# EAGLE design PaPArray_full (EAGLE 6.3)
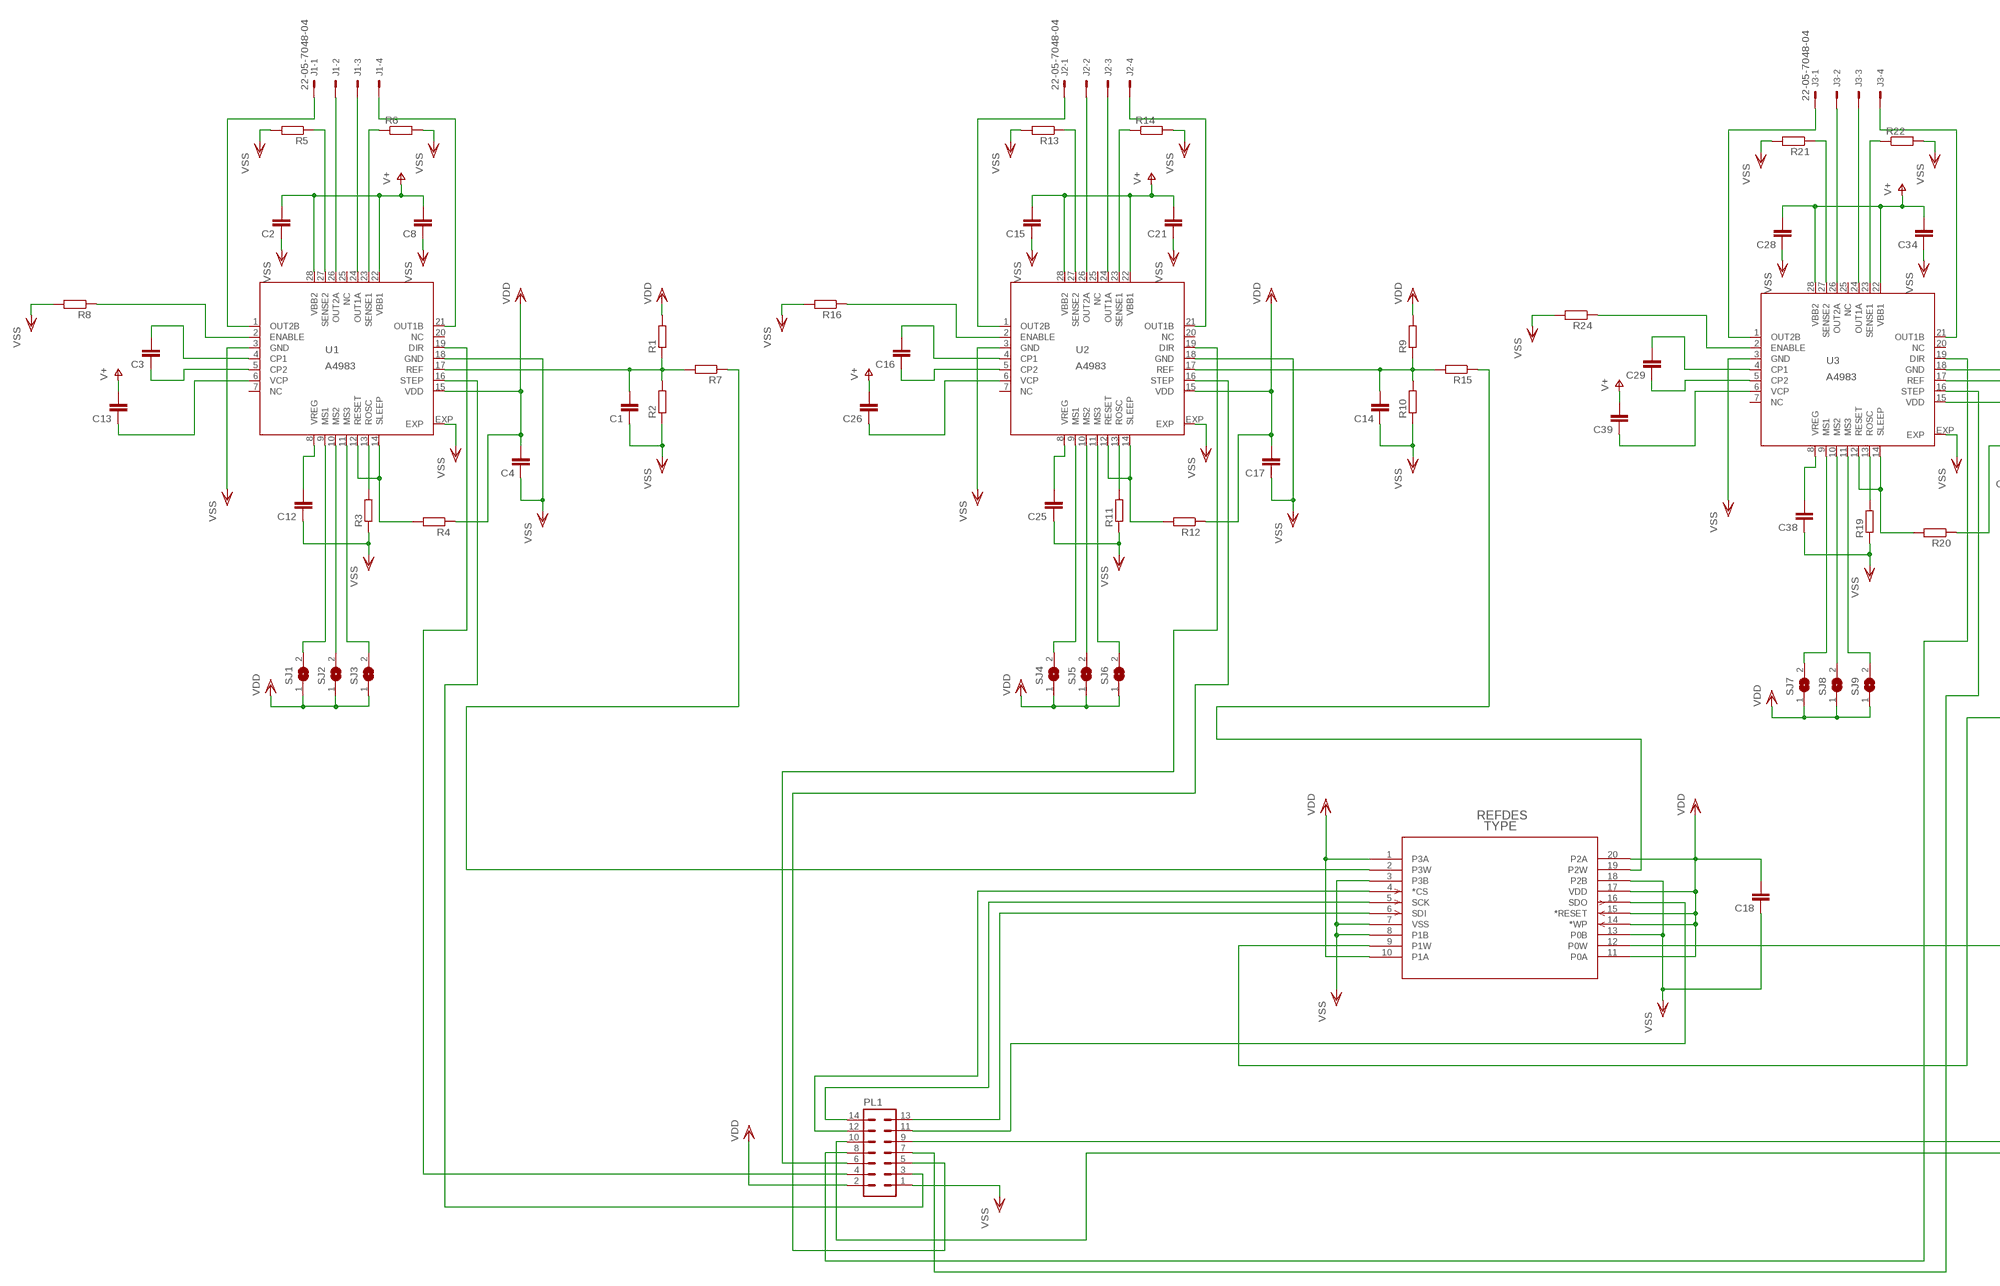
[diagram p0: schematic, sheet 1, part 1 of 2]
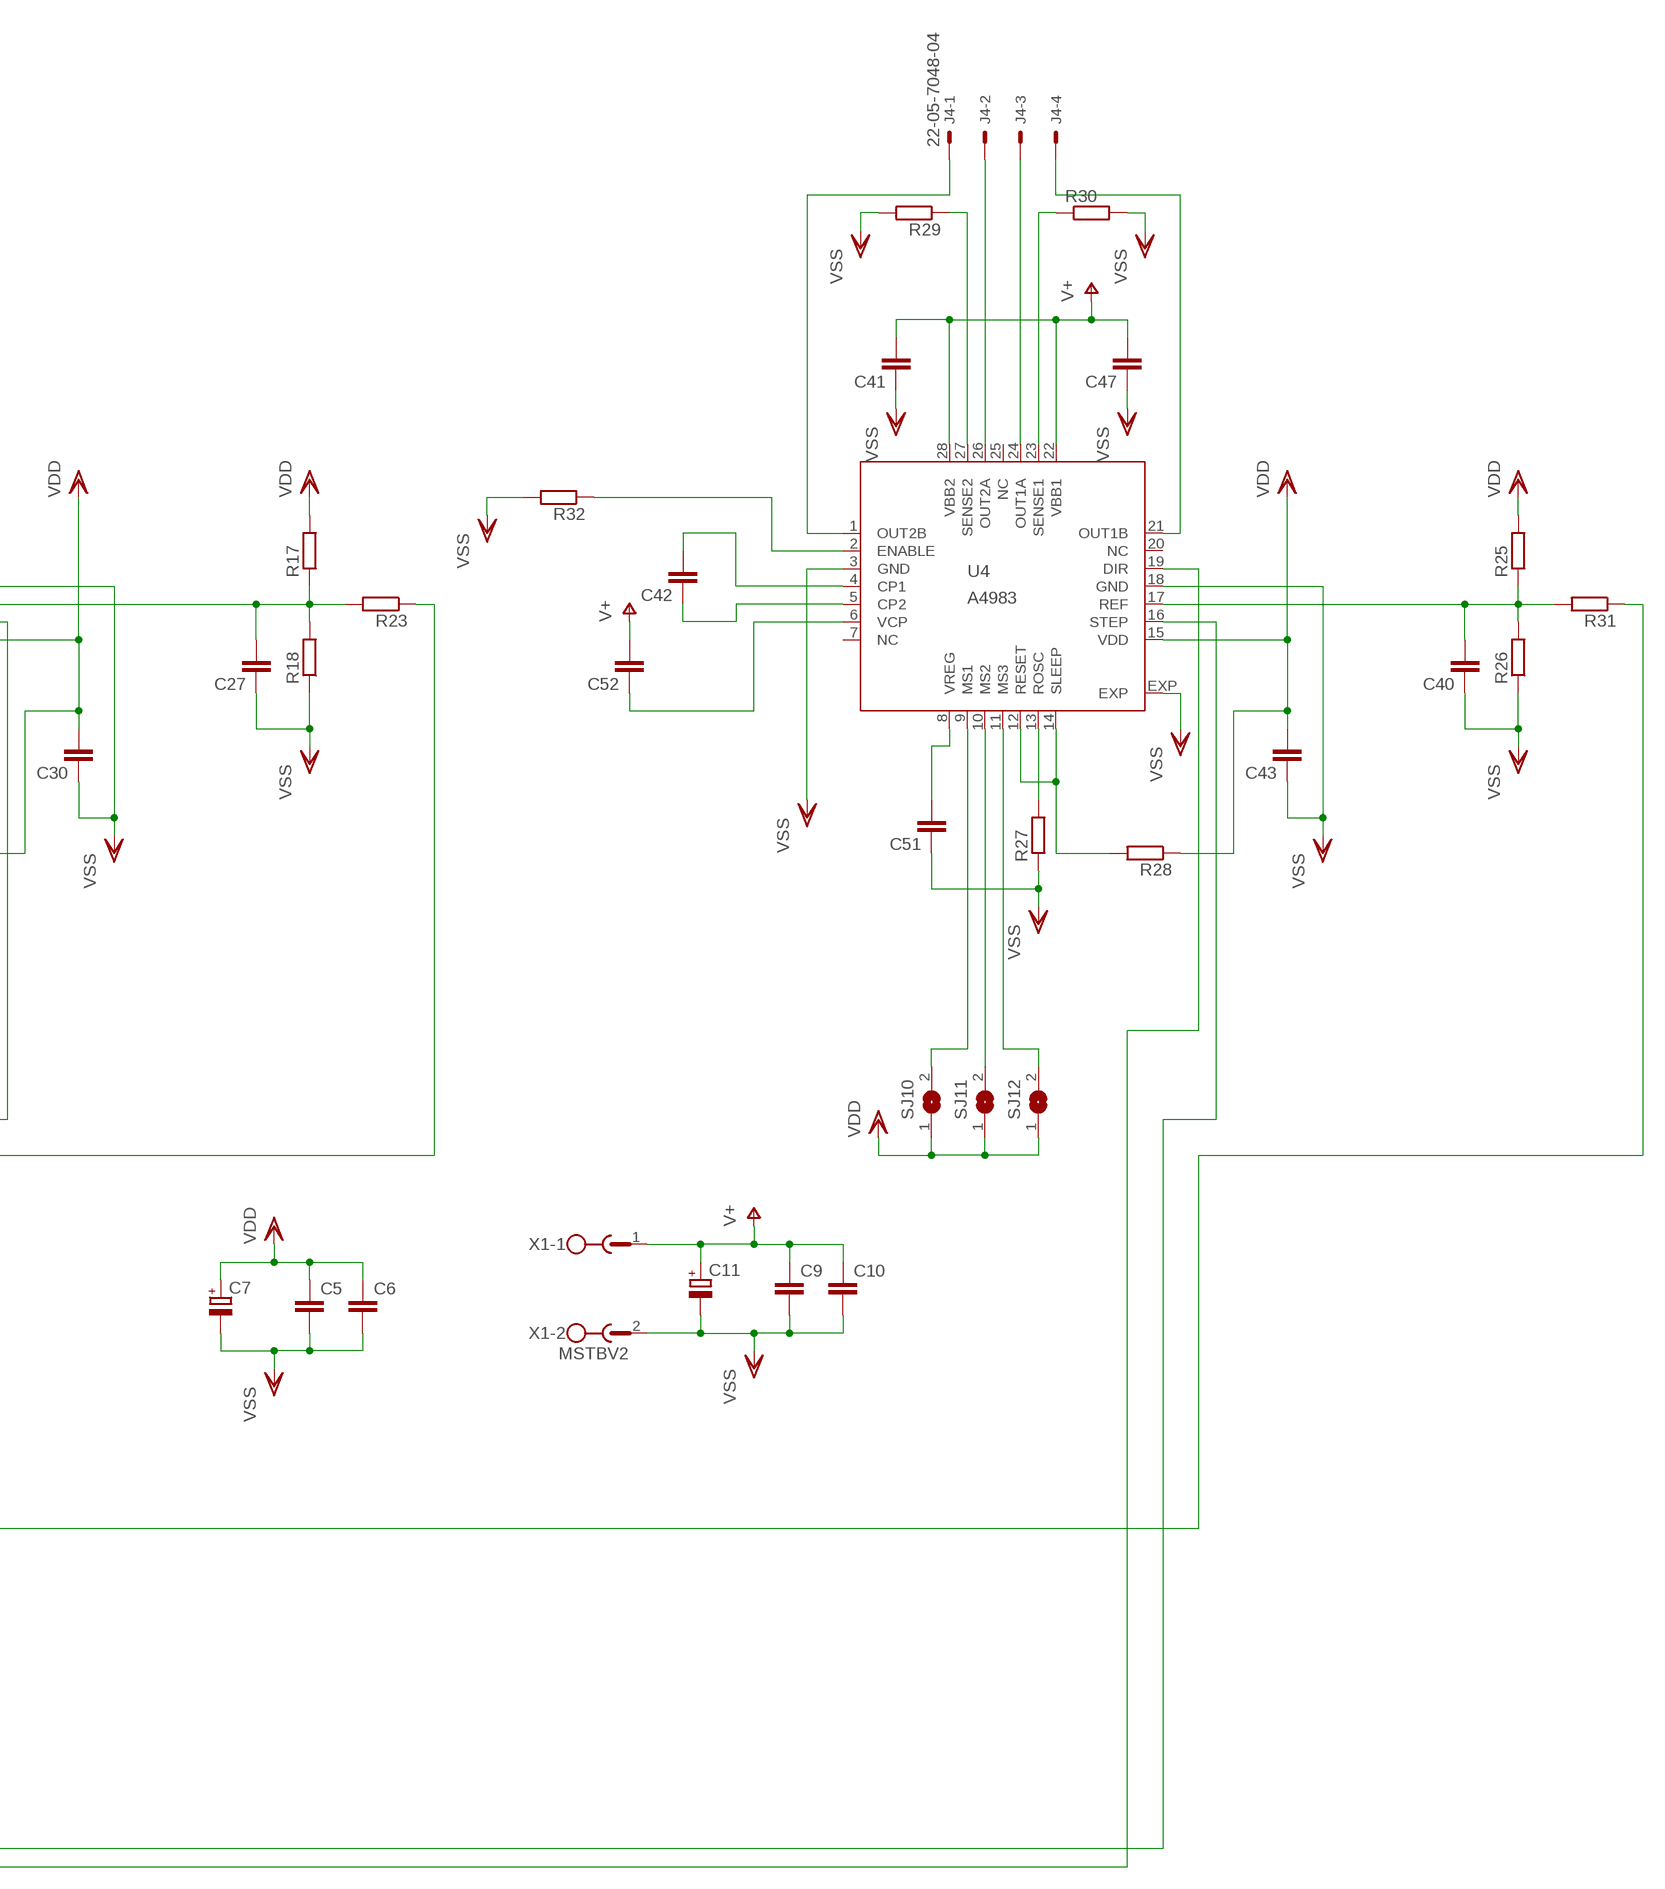
[diagram p1: schematic, sheet 1, part 2 of 2]

## Parts
C1  C-EUC0603  [C0603]
C2  C-EUC0603  [C0603]
C3  C-EUC0603  [C0603]
C4  C-EUC0603  [C0603]
C5  C-EUC0603  [C0603]
C6  C-EUC0603  [C0603]
C7  CPOL-EUE5-5  [E5-5]
C8  C-EUC0603  [C0603]
C9  C-EUC0603  [C0603]
C10  C-EUC0603  [C0603]
C11  CPOL-EUE5-5  [E5-5]
C12  C-EUC0603  [C0603]
C13  C-EUC0603  [C0603]
C14  C-EUC0603  [C0603]
C15  C-EUC0603  [C0603]
C16  C-EUC0603  [C0603]
C17  C-EUC0603  [C0603]
C18  C-EUC0603  [C0603]
C21  C-EUC0603  [C0603]
C25  C-EUC0603  [C0603]
C26  C-EUC0603  [C0603]
C27  C-EUC0603  [C0603]
C28  C-EUC0603  [C0603]
C29  C-EUC0603  [C0603]
C30  C-EUC0603  [C0603]
C34  C-EUC0603  [C0603]
C38  C-EUC0603  [C0603]
C39  C-EUC0603  [C0603]
C40  C-EUC0603  [C0603]
C41  C-EUC0603  [C0603]
C42  C-EUC0603  [C0603]
C43  C-EUC0603  [C0603]
C47  C-EUC0603  [C0603]
C51  C-EUC0603  [C0603]
C52  C-EUC0603  [C0603]
J1  22-05-7048-04  [7395-04]
J2  22-05-7048-04  [7395-04]
J3  22-05-7048-04  [7395-04]
J4  22-05-7048-04  [7395-04]
PL1  14V  [14V]
R1  R-EU_R0805  [R0805]
R2  R-EU_R0805  [R0805]
R3  R-EU_R0805  [R0805]
R4  R-EU_R0805  [R0805]
R5  R-EU_R2512  [R2512]
R6  R-EU_R2512  [R2512]
R7  R-EU_R0805  [R0805]
R8  R-EU_R0805  [R0805]
R9  R-EU_R0805  [R0805]
R10  R-EU_R0805  [R0805]
R11  R-EU_R0805  [R0805]
R12  R-EU_R0805  [R0805]
R13  R-EU_R2512  [R2512]
R14  R-EU_R2512  [R2512]
R15  R-EU_R0805  [R0805]
R16  R-EU_R0805  [R0805]
R17  R-EU_R0805  [R0805]
R18  R-EU_R0805  [R0805]
R19  R-EU_R0805  [R0805]
R20  R-EU_R0805  [R0805]
R21  R-EU_R2512  [R2512]
R22  R-EU_R2512  [R2512]
R23  R-EU_R0805  [R0805]
R24  R-EU_R0805  [R0805]
R25  R-EU_R0805  [R0805]
R26  R-EU_R0805  [R0805]
R27  R-EU_R0805  [R0805]
R28  R-EU_R0805  [R0805]
R29  R-EU_R2512  [R2512]
R30  R-EU_R2512  [R2512]
R31  R-EU_R0805  [R0805]
R32  R-EU_R0805  [R0805]
SJ1  SJ  [SJ]
SJ2  SJ  [SJ]
SJ3  SJ  [SJ]
SJ4  SJ  [SJ]
SJ5  SJ  [SJ]
SJ6  SJ  [SJ]
SJ7  SJ  [SJ]
SJ8  SJ  [SJ]
SJ9  SJ  [SJ]
SJ10  SJ  [SJ]
SJ11  SJ  [SJ]
SJ12  SJ  [SJ]
U1  A4983  [QFN28ET]
U2  A4983  [QFN28ET]
U3  A4983  [QFN28ET]
U4  A4983  [QFN28ET]
U$1  MCP4341-XXXX_ST  [TSSOP20_MC]
X1  MSTBV2  [MSTBV2]

## Nets
N$1: J1.3 U1.24(OUT1A)
N$2: J1.4 U1.21(OUT1B)
N$3: J1.2 U1.26(OUT2A)
N$4: J1.1 U1.1(OUT2B)
N$5: R5.1 U1.27(SENSE2)
N$6: R6.1 U1.23(SENSE1)
N$7: R3.2 U1.13(ROSC)
N$8: C3.2 U1.4(CP1)
N$9: C3.1 U1.5(CP2)
N$10: C1.2 R1.1 R2.2 R7.2 U1.17(REF)
N$11: C12.2 U1.8(VREG)
N$12: R31.1 U$1.12(P0W)
N$13: R4.2 U1.12(RESET) U1.14(SLEEP)
N$14: J2.3 U2.24(OUT1A)
N$15: J2.4 U2.21(OUT1B)
N$16: J2.2 U2.26(OUT2A)
N$17: J2.1 U2.1(OUT2B)
N$18: R13.1 U2.27(SENSE2)
N$19: SJ1.2 U1.9(MS1)
N$20: SJ2.2 U1.10(MS2)
N$21: SJ3.2 U1.11(MS3)
N$22: R7.1 U$1.2(P3W)
N$23: PL1.3 U1.16(STEP)
N$24: PL1.4 U1.19(DIR)
N$25: C13.1 U1.6(VCP)
N$26: R14.1 U2.23(SENSE1)
N$27: C14.2 R9.1 R10.2 R15.2 U2.17(REF)
N$28: C16.2 U2.4(CP1)
N$29: C16.1 U2.5(CP2)
N$30: R11.2 U2.13(ROSC)
N$31: C25.2 U2.8(VREG)
N$32: R12.2 U2.12(RESET) U2.14(SLEEP)
N$33: SJ4.2 U2.9(MS1)
N$34: SJ5.2 U2.10(MS2)
N$35: SJ6.2 U2.11(MS3)
N$36: PL1.5 U2.16(STEP)
N$37: PL1.6 U2.19(DIR)
N$38: C26.1 U2.6(VCP)
N$39: PL1.12 U$1.4(*CS)
N$40: R15.1 U$1.19(P2W)
N$41: J3.3 U3.24(OUT1A)
N$42: J3.4 U3.21(OUT1B)
N$43: J3.2 U3.26(OUT2A)
N$44: J3.1 U3.1(OUT2B)
N$45: R21.1 U3.27(SENSE2)
N$46: R22.1 U3.23(SENSE1)
N$47: C27.2 R17.1 R18.2 R23.2 U3.17(REF)
N$48: C29.2 U3.4(CP1)
N$49: C29.1 U3.5(CP2)
N$50: R19.2 U3.13(ROSC)
N$51: C38.2 U3.8(VREG)
N$52: R20.2 U3.12(RESET) U3.14(SLEEP)
N$53: SJ7.2 U3.9(MS1)
N$54: SJ8.2 U3.10(MS2)
N$55: SJ9.2 U3.11(MS3)
N$56: PL1.7 U3.16(STEP)
N$57: PL1.8 U3.19(DIR)
N$58: C39.1 U3.6(VCP)
N$59: R16.1 U2.2(ENABLE)
N$60: PL1.14 U$1.5(SCK)
N$61: J4.3 U4.24(OUT1A)
N$62: J4.4 U4.21(OUT1B)
N$63: J4.2 U4.26(OUT2A)
N$64: J4.1 U4.1(OUT2B)
N$65: R29.1 U4.27(SENSE2)
N$66: R30.1 U4.23(SENSE1)
N$67: C40.2 R25.1 R26.2 R31.2 U4.17(REF)
N$68: C42.2 U4.4(CP1)
N$69: C42.1 U4.5(CP2)
N$70: R27.2 U4.13(ROSC)
N$71: C51.2 U4.8(VREG)
N$72: R28.2 U4.12(RESET) U4.14(SLEEP)
N$73: SJ10.2 U4.9(MS1)
N$74: SJ11.2 U4.10(MS2)
N$75: SJ12.2 U4.11(MS3)
N$76: PL1.9 U4.16(STEP)
N$78: C52.1 U4.6(VCP)
N$79: R23.1 U$1.9(P1W)
N$80: PL1.13 U$1.6(SDI)
N$81: PL1.11 U$1.16(SDO)
N$82: R32.1 U4.2(ENABLE)
N$83: R8.1 U1.2(ENABLE)
N$84: R24.1 U3.2(ENABLE)
N$85: PL1.10 U4.19(DIR)
V+: C2.2 C8.2 C9.1 C10.1 C11.+ C13.2 C15.2 C21.2 C26.2 C28.2 C34.2 C39.2 C41.2 C47.2 C52.2 U1.22(VBB1) U1.28(VBB2) U2.22(VBB1) U2.28(VBB2) U3.22(VBB1) U3.28(VBB2) U4.22(VBB1) U4.28(VBB2) X1.1
VDD: C4.2 C5.1 C6.1 C7.+ C17.2 C18.2 C30.2 C43.2 PL1.2 R1.2 R4.1 R9.2 R12.1 R17.2 R20.1 R25.2 R28.1 SJ1.1 SJ2.1 SJ3.1 SJ4.1 SJ5.1 SJ6.1 SJ7.1 SJ8.1 SJ9.1 SJ10.1 SJ11.1 SJ12.1 U1.15(VDD) U2.15(VDD) U3.15(VDD) U4.15(VDD) U$1.1(P3A) U$1.10(P1A) U$1.11(P0A) U$1.14(*WP) U$1.15(*RESET) U$1.17(VDD) U$1.20(P2A)
VSS: C1.1 C2.1 C4.1 C5.2 C6.2 C7.- C8.1 C9.2 C10.2 C11.- C12.1 C14.1 C15.1 C17.1 C18.1 C21.1 C25.1 C27.1 C28.1 C30.1 C34.1 C38.1 C40.1 C41.1 C43.1 C47.1 C51.1 PL1.1 R2.1 R3.1 R5.2 R6.2 R8.2 R10.1 R11.1 R13.2 R14.2 R16.2 R18.1 R19.1 R21.2 R22.2 R24.2 R26.1 R27.1 R29.2 R30.2 R32.2 U1.3(GND) U1.18(GND) U1.EXP U2.3(GND) U2.18(GND) U2.EXP U3.3(GND) U3.18(GND) U3.EXP U4.3(GND) U4.18(GND) U4.EXP U$1.3(P3B) U$1.7(VSS) U$1.8(P1B) U$1.13(P0B) U$1.18(P2B) X1.2
Unconnected: U1.7(NC) U1.20(NC) U1.25(NC) U2.7(NC) U2.20(NC) U2.25(NC) U3.7(NC) U3.20(NC) U3.25(NC) U4.7(NC) U4.20(NC) U4.25(NC)

## Library data of the parts
C1-C6 C8-C10 C12-C18 C21 C25-C30 C34 C38-C43 C47 C51 C52 = rcl:C-EU: CAPACITOR, European symbol
C7 C11 = rcl:CPOL-EU: POLARIZED CAPACITOR, European symbol
J1-J4 = con-molex:22-?-04: CONNECTOR wire to board 2.54 mm (.1 inch) pitch header; OC_FARNELL: unknown; OC_NEWARK: unknown
PL1 = con-harting-v:14V: CONNECTOR; OC_FARNELL: unknown; OC_NEWARK: unknown
R1-R32 = rcl:R-EU_: RESISTOR, European symbol
SJ1-SJ12 = jumper:SJ: SMD solder JUMPER
U1-U4 = allegro:A4983: DMOS Microstepping Driver with Translator Auto generated by make-symbol-device-package-bsdl.ulp Rev. 32 Source: http://www.allegromicro.com/en/Products/Part_Numbers/4983/4983.pdf; MPN: A4983SETTR-T; OC_FARNELL: 1688956; OC_NEWARK: 39M6763
U$1 = microchip_mcp41xx:MCP4341-XXXX_ST
X1 = con-phoenix-508:MSTBV2: PHOENIX; MPN: MSTBV 2,5/2-GF-5.08; OC_FARNELL: 1792792; OC_NEWARK: 69R9845

## Board
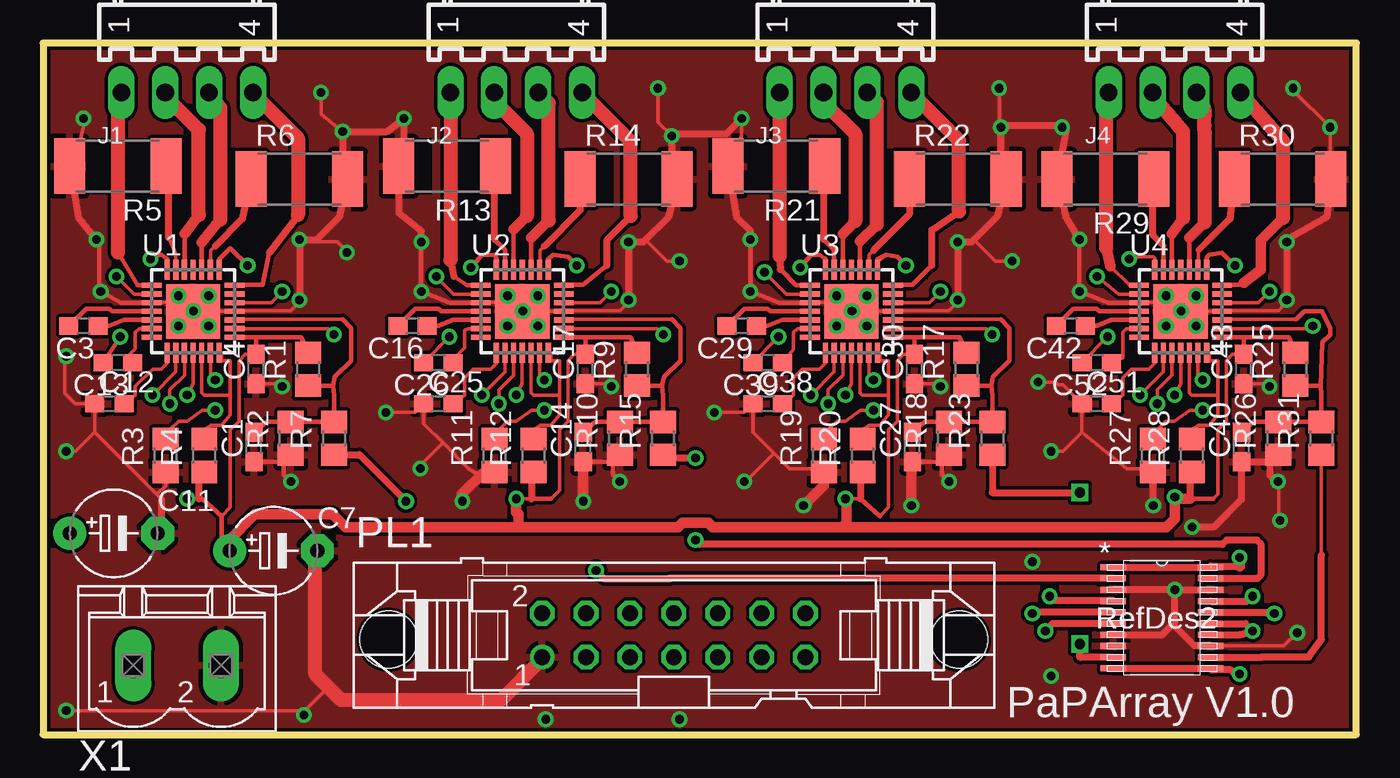
[diagram p2: board, top side]
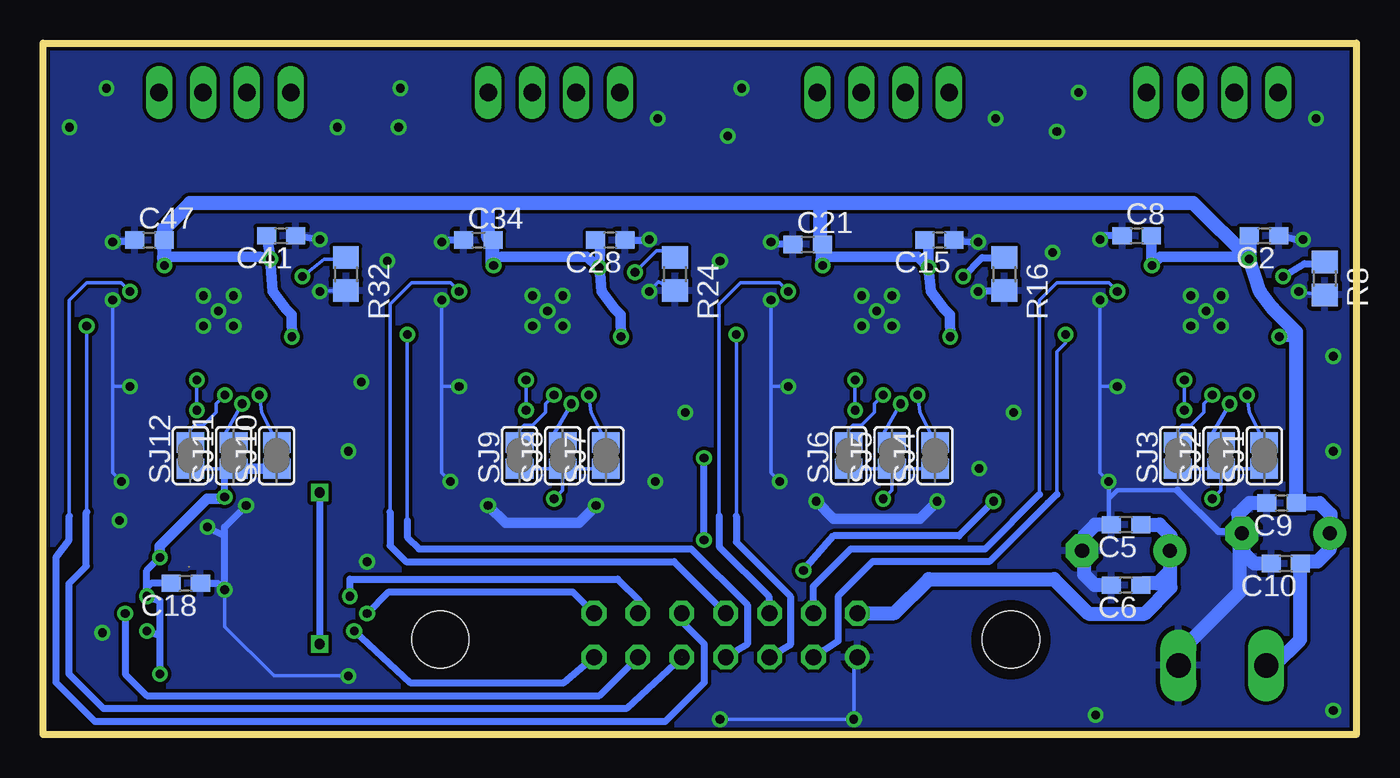
[diagram p3: board, bottom side, seen from below]

Size 76 x 40 mm. Coordinates in mm from the lower left corner, seen from the top.
Outline: 0,0 76,0 76,40 0,40 0,0
Copper layers (1*16): Top 0.035mm / dielectric 1.5mm / Bottom 0.035mm
Design rules "dipole_elec": minimum track width 0.2mm, minimum drill 0.3mm, track to track 0.2mm, track to pad 0.2mm, pad to pad 0.2mm, via to via 0.2mm, smd to smd 0.2mm, copper to edge 0.2mm, drill to drill 0.2mm, minimum pad ring 10mil, minimum via ring 8mil, stop-mask expansion 4mil, vias tented up to drill 0mil, thermal gap 10mil
tRestrict: area 2.5,31.2 to 3.5,34.5; area 5,31.2 to 6,34.5; area 13,30.5 to 14,33.8; area 15.5,30.5 to 16.5,33.8; area 21.5,31.2 to 22.5,34.5; area 24.2,31.2 to 25.2,34.5; area 32,30.5 to 33,33.8; area 34.8,30.5 to 35.8,33.8; area 40.8,31.2 to 41.8,34.5; area 43.2,31.2 to 44.2,34.5; area 51.2,30.5 to 52.2,33.8; area 53.8,30.5 to 54.8,33.8; 4 more areas

### Footprints (pad centres in the part's own frame; a part is rotated, then mirrored left to right if it is on the bottom)
C0603 = smd 1.1 x 1: 1 -0.85,0; 2 0.85,0
E5-5 = drill 0.813 pad 1.905: + -2.54,0 | drill 0.813 pad 1.905 octagon: - 2.54,0
7395-04 = drill 1.016 long: 1 3.81,0; 2 1.27,0; 3 -1.27,0; 4 -3.81,0
14V = drill 0.914: 1 -7.62,-1.27 | drill 0.914 octagon: 2 -7.62,1.27; 3 -5.08,-1.27; 4 -5.08,1.27; 5 -2.54,-1.27; 6 -2.54,1.27; 7 0,-1.27; 8 0,1.27; 9 2.54,-1.27; 10 2.54,1.27; 11 5.08,-1.27; 12 5.08,1.27; 13 7.62,-1.27; 14 7.62,1.27 | hole 3.302: 16.51,-0.254; -16.51,-0.254
R0805 = smd 1.3 x 1.5: 1 -0.95,0; 2 0.95,0
R2512 = smd 1.8 x 3.2: 1 -2.8,0; 2 2.8,0
SJ = smd 1.168 x 1.6: 1 -0.762,0; 2 0.762,0
QFN28ET = smd 1.15 x 0.3: 1 -2.4,1.5; 2 -2.4,1; 3 -2.4,0.5; 4 -2.4,0; 5 -2.4,-0.5; 6 -2.4,-1; 7 -2.4,-1.5; 15 2.4,-1.5; 16 2.4,-1; 17 2.4,-0.5; 18 2.4,0; 19 2.4,0.5; 20 2.4,1; 21 2.4,1.5 | smd 0.3 x 1.15: 8 -1.5,-2.4; 9 -1,-2.4; 10 -0.5,-2.4; 11 0,-2.4; 12 0.5,-2.4; 13 1,-2.4; 14 1.5,-2.4; 22 1.5,2.4; 23 1,2.4; 24 0.5,2.4; 25 0,2.4; 26 -0.5,2.4; 27 -1,2.4; 28 -1.5,2.4 | smd 3.15 x 3.15: EXP 0,0
TSSOP20_MC = smd 1.473 x 0.356: 1 -2.819,2.921; 2 -2.819,2.286; 3 -2.819,1.626; 4 -2.819,0.965; 5 -2.819,0.33; 6 -2.819,-0.33; 7 -2.819,-0.965; 8 -2.819,-1.626; 9 -2.819,-2.286; 10 -2.819,-2.921; 11 2.819,-2.921; 12 2.819,-2.286; 13 2.819,-1.626; 14 2.819,-0.965; 15 2.819,-0.33; 16 2.819,0.33; 17 2.819,0.965; 18 2.819,1.626; 19 2.819,2.286; 20 2.819,2.921
MSTBV2 = drill 1.397 long: 1 -2.54,0; 2 2.54,0

### Placement (x,y rotation side)
C1  12.21,16.64 90 top
C2  5.33,28.86 180 bottom
C3  2.33,23.64 180 top
C4  12.33,21.14 90 top
C5  13.33,12.14 180 bottom
C6  13.33,8.64 180 bottom
C7  13.33,10.64 0 top
C8  12.71,28.86 0 bottom
C9  4.33,13.39 180 bottom
C10  4.08,9.89 180 bottom
C11  4.08,11.64 0 top
C12  3.83,19.14 0 top
C13  4.33,21.52 180 top
C14  31.25,16.64 90 top
C15  24.13,28.61 180 bottom
C16  21.38,23.64 180 top
C17  31.38,21.14 90 top
C18  67.75,8.75 180 bottom
C21  31.75,28.36 0 bottom
C25  22.88,19.14 0 top
C26  22.88,21.52 180 top
C27  50.3,16.64 90 top
C28  43.18,28.61 180 bottom
C29  40.43,23.64 180 top
C30  50.43,21.14 90 top
C34  50.8,28.61 0 bottom
C38  41.93,19.14 0 top
C39  41.93,21.52 180 top
C40  69.36,16.64 90 top
C41  62.23,28.86 180 bottom
C42  59.48,23.64 180 top
C43  69.48,21.14 90 top
C47  69.86,28.61 0 bottom
C51  60.98,19.14 0 top
C52  60.98,21.52 180 top
J1  8.33,37.14 180 top
J2  27.38,37.14 180 top
J3  46.43,37.14 180 top
J4  65.48,37.14 180 top
PL1  36.5,5.75 0 top
R1  15.33,21.14 90 top
R2  14.33,17.14 90 top
R3  7.08,16.14 90 top
R4  9.33,16.14 90 top
R5  4.33,32.89 180 top
R6  14.83,32.14 0 top
R7  16.83,17.14 90 top
R8  1.83,26.39 270 bottom
R9  34.38,21.14 90 top
R10  33.38,17.14 90 top
R11  26.13,16.14 90 top
R12  28.38,16.14 90 top
R13  23.38,32.89 180 top
R14  33.88,32.14 0 top
R15  35.88,17.14 90 top
R16  20.38,26.64 270 bottom
R17  53.43,21.14 90 top
R18  52.43,17.14 90 top
R19  45.18,16.14 90 top
R20  47.43,16.14 90 top
R21  42.43,32.89 180 top
R22  52.93,32.14 0 top
R23  54.93,17.14 90 top
R24  39.43,26.64 270 bottom
R25  72.48,21.14 90 top
R26  71.48,17.14 90 top
R27  64.23,16.14 90 top
R28  66.48,16.14 90 top
R29  61.48,32.14 180 top
R30  71.73,32.14 0 top
R31  73.98,17.14 90 top
R32  58.48,26.64 270 bottom
SJ1  5.33,16.14 90 bottom
SJ2  7.83,16.14 90 bottom
SJ3  10.33,16.14 90 bottom
SJ4  24.38,16.14 90 bottom
SJ5  26.88,16.14 90 bottom
SJ6  29.38,16.14 90 bottom
SJ7  43.43,16.14 90 bottom
SJ8  45.93,16.14 90 bottom
SJ9  48.43,16.14 90 bottom
SJ10  62.48,16.14 90 bottom
SJ11  64.98,16.14 90 bottom
SJ12  67.48,16.14 90 bottom
U1  8.68,24.49 0 top
U2  27.73,24.49 0 top
U3  46.78,24.49 0 top
U4  65.83,24.49 0 top
U$1  64.75,6.75 0 top
X1  7.75,4 0 top

### Tracks (layer width: path | path; a pad name or v marks a point on that pad's centre or on a via)
N$1
  Top 0.254: U1.24 9.18,28.49
  Top 0.61: 9.18,28.49 10.25,29.81
  Top 0.813: J1.3 10.25,36.24 10.25,29.81
N$2
  Top 0.254: U1.21 11.11,26.02 12.71,26.02 13.08,27.89
  Top 0.406: J1.4 12.14,37.11 | 14.75,30.06 13.08,27.89
  Top 0.813: 12.14,37.11 14.75,34.5 14.75,30.06
N$3
  Top 0.254: U1.26 8.18,28.99
  Top 0.61: 8.18,28.99 9,30.06
  Top 0.813: 9,30.06 9,35 7.06,36.94 J1.2
N$4
  Top 0.254: U1.1 5.48,25.99 4.33,27.89
  Top 0.813: 4.33,27.89 4.33,36.83 J1.1
N$5
  Top 0.2: U1.27 7.68,27.82 7.25,28.75
  Top 0.254: 7.08,32.84 R5.1
  Top 0.406: 7.25,28.75 7.25,32.76 7.08,32.84
N$6
  Top 0.2: 9.71,26.91 9.71,28.02 9.96,28.27
  Top 0.254: 9.71,26.91 U1.23
  Top 0.406: R6.1 11.53,29.84 9.96,28.27
N$7  (via drill 0.5 pad 0.25)
  Top 0.2: R3.2 7.33,17.64 7.83,18.14 8.33,18.14 9.21,18.77 v9.96,18.77 | U1.13 9.68,20.79 v9.96,20.52
  Bottom 0.2: v9.96,20.52 v9.96,18.77
N$8
  Top 0.254: U1.4 3.98,24.49 3.83,24.64 2.48,24.64 C3.2
N$9
  Top 0.254: U1.5 4.68,23.99 3.83,23.64 C3.1
N$10
  Top 0.2: 17.33,24.02 11.11,24.02
  Top 0.254: 16.78,20.19 16.83,19.64 R7.2 R2.2 12.93,18.09 C1.2 | R1.1 16.78,20.19 | 16.78,20.19 16.88,20.69 17.83,21.64 17.83,23.52 17.33,24.02 | 11.11,24.02 U1.17
N$11
  Top 0.2: U1.8 7.18,21.49 6.83,21.14 6.33,21.14 5.33,20.14 5.33,19.64 C12.2
N$12
  Top 0.2: R31.1 73.98,10.39
  Top 0.406: 73.98,10.39 73.98,5.5 73.25,4.5 70.5,4.5 | 70.5,4.46 70.5,4.5 | U$1.12 70.46,4.46 70.5,4.5
N$13
  Top 0.2: U1.12 9.18,19.79 9.33,19.64 10.83,19.64 | 10.83,19.64 10.83,21.64 10.33,21.64 10.33,21.94 U1.14 | R4.2 9.33,17.64 9.71,17.89 10.33,17.89 10.83,18.52 10.83,19.64
N$14
  Top 0.254: U2.24 28.23,28.74
  Top 0.406: 28.23,28.74 28.24,28.74
  Top 0.61: 28.24,28.74 29.25,29.75
  Top 0.813: 29.25,29.75 29.25,36.54 J2.3
N$15
  Top 0.254: U2.21 30.16,26.02 31.25,26.02 32.63,27.14
  Top 0.406: 32.63,27.14 32.64,28.64 34,30
  Top 0.813: 34,30 34,34.33 J2.4
N$16
  Top 0.254: U2.26 27.23,29.24
  Top 0.61: 28,30.01 27.23,29.24
  Top 0.813: 28,30.01 28,34.75 26.38,36.37 26.38,36.91 26.34,36.91 J2.2
N$17
  Top 0.254: U2.1 24.53,25.99 23.76,26.51
  Top 0.406: 23.57,27.45 23.76,26.51
  Top 0.813: J2.1 23.57,27.45
N$18
  Top 0.254: U2.27 26.73,28.04 26.13,28.64 | 26.13,31.34 R13.1
  Top 0.406: 26.13,28.64 26.13,31.34
N$19  (via drill 0.5 pad 0.25)
  Top 0.2: U1.9 7.68,20.99 v6.33,19.64
  Bottom 0.2: 5.33,17.14 SJ1.2 6.21,18.65 v6.33,19.64
N$20  (via drill 0.5 pad 0.25)
  Top 0.2: U1.10 8.18,20.79 7.33,19.94 v7.33,19.14
  Bottom 0.2: v7.33,19.14 8.33,17.4 SJ2.2
N$21  (via drill 0.5 pad 0.25)
  Top 0.2: U1.11 8.68,20.29 v8.33,19.64
  Bottom 0.2: v8.33,19.64 8.83,19.14 8.83,18.64 9.58,17.89 10.08,17.89 10.33,17.64 SJ3.2
N$22  (via drill 0.5)
  Top 0.406: 36.21,9.04 36.25,9 | 36.25,9 32.5,9 v32,9.5 | R7.1 18.31,16.19 v21,13.5 | U$1.2 36.29,9.04 36.25,9
  Bottom 0.406: v21,13.5 23,11.5 30.25,11.5 v32,9.5
N$23  (via drill 0.5 pad 0.25)
  Top 0.2: U1.16 16.48,23.49 v16.83,23.14
  Bottom 0.2: 17.33,13.89 17.33,22.14 16.83,22.64 v16.83,23.14
  Bottom 0.406: 17.33,13.89 17.86,13.39 21.25,10 28,10 30,8 30,5.4 PL1.3
N$24  (via drill 0.5 pad 0.25)
  Top 0.2: v13.83,25.64 13.18,24.99 U1.19
  Bottom 0.2: v13.83,25.64 14.33,26.14 17.33,26.14 18.33,25.14 18.33,13.89
  Bottom 0.406: PL1.4 31.42,8.58 29.25,10.75 21.47,10.75 18.33,13.89
N$25
  Top 0.2: U1.6 5.55,23.49 5.33,23.27 5.33,22.33 5.12,22.12 4.83,21.79 C13.1
N$26
  Top 0.2: 28.75,26.91 28.75,28.02 29,28.27
  Top 0.254: 28.75,26.91 U2.23
  Top 0.406: R14.1 31.08,30.34 29,28.27
N$27
  Top 0.2: 36.38,24.02 30.16,24.02
  Top 0.254: 35.83,20.19 35.88,19.64 R15.2 R10.2 31.98,18.09 C14.2 | R9.1 35.83,20.19 | 35.83,20.19 35.93,20.69 36.88,21.64 36.88,23.52 36.38,24.02 | 30.16,24.02 U2.17
N$28
  Top 0.254: U2.4 23.03,24.49 22.88,24.64 21.53,24.64 C16.2
N$29
  Top 0.254: U2.5 23.73,23.99 22.88,23.64 C16.1
N$30  (via drill 0.5 pad 0.25)
  Top 0.2: R11.2 26.38,17.64 26.88,18.14 27.38,18.14 28.25,18.77 v29,18.77 | U2.13 28.73,20.79 v29,20.52
  Bottom 0.2: v29,20.52 v29,18.77
N$31
  Top 0.2: U2.8 26.23,21.49 25.88,21.14 24.88,21.14 24.38,20.64 24.38,19.64 C25.2
N$32
  Top 0.2: U2.12 28.23,19.79 28.38,19.64 29.88,19.64 | 29.88,19.64 29.88,21.64 29.38,21.64 29.38,21.94 U2.14 | R12.2 28.38,17.64 28.75,17.89 29.38,17.89 29.88,18.52 29.88,19.64
N$33  (via drill 0.5 pad 0.25)
  Top 0.2: U2.9 26.73,20.99 v25.38,19.64
  Bottom 0.2: 24.38,17.14 SJ4.2 25.25,18.65 v25.38,19.64
N$34  (via drill 0.5 pad 0.25)
  Top 0.2: U2.10 27.23,20.79 26.38,19.94 v26.38,19.14
  Bottom 0.2: v26.38,19.14 27.38,17.4 SJ5.2
N$35  (via drill 0.5 pad 0.25)
  Top 0.2: U2.11 27.73,20.29 v27.38,19.64
  Bottom 0.2: v27.38,19.64 27.88,19.14 27.88,18.64 28.63,17.89 29.13,17.89 29.38,17.64 SJ6.2
N$36  (via drill 0.5 pad 0.25)
  Top 0.2: U2.16 35.53,23.49 v35.88,23.14
  Bottom 0.2: 35.88,12.64 v35.88,23.14
  Bottom 0.406: 35.88,12.64 35.88,11.13 32.75,8 32.75,5.19 PL1.5
N$37  (via drill 0.5 pad 0.25)
  Top 0.2: v32.88,25.64 32.23,24.99 U2.19
  Bottom 0.2: v32.88,25.64 33.38,26.14 35.63,26.14 36.88,24.89 36.88,12.64
  Bottom 0.406: 36.88,12.64 36.88,10.88 34,8 34,7.06 PL1.6
N$38
  Top 0.2: U2.6 24.61,23.49 24.38,23.39 24.38,22.38 24,22 23.88,21.79 C26.1
N$39  (via drill 0.5)
  Top 0.406: U$1.4 61.93,7.75 58.5,7.75 v58.25,8
  Bottom 0.406: v58.25,8 58.25,9 42.75,9 41.5,7.75 41.5,7.1 PL1.12
N$40  (via drill 0.5)
  Top 0.406: v37.75,11.25 38,11 68.25,11 68.5,11.25 70.25,11.25 70.5,11 70.5,9.25 70.29,9.04 U$1.19 | v37.75,16 36.07,16
  Top 0.61: 36.07,16 R15.1
  Bottom 0.406: v37.75,11.25 v37.75,16
N$41
  Top 0.254: U3.24 47.28,28.49
  Top 0.406: 47.28,28.49 47.28,28.53
  Top 0.61: 47.28,28.53 48.25,29.5
  Top 0.813: 48.25,29.5 48.25,36.59 J3.3
N$42
  Top 0.254: U3.21 49.2,26.02 50.3,26.02 51.43,27.14
  Top 0.406: 51.43,27.14 51.43,29.18 53,30.25
  Top 0.813: 53,30.25 53,34.38 J3.4
N$43
  Top 0.254: U3.26 46.28,28.99
  Top 0.61: 47,29.71 46.28,28.99
  Top 0.813: J3.2 45.16,36.59 47,34.75 47,29.71
N$44
  Top 0.254: U3.1 43.58,25.99 42.66,26.91
  Top 0.406: 42.62,27.7 42.66,26.91
  Top 0.813: J3.1 42.62,27.7
N$45
  Top 0.254: U3.27 45.78,28.04 45.18,28.64 | 45.18,31.34 R21.1
  Top 0.406: 45.18,28.64 45.18,31.34
N$46
  Top 0.2: 47.8,26.91 47.8,27.77 48.05,28.02
  Top 0.254: 47.8,26.91 U3.23
  Top 0.406: R22.1 50.13,30.09 48.05,28.02
N$47
  Top 0.2: 55.43,24.02 49.2,24.02
  Top 0.254: 54.88,20.19 54.93,19.64 R23.2 R18.2 51.03,18.09 C27.2 | R17.1 54.88,20.19 | 54.88,20.19 54.98,20.69 55.93,21.64 55.93,23.52 55.43,24.02 | 49.2,24.02 U3.17
N$48
  Top 0.254: U3.4 42.08,24.49 41.93,24.64 40.58,24.64 C29.2
N$49
  Top 0.254: U3.5 42.78,23.99 41.93,23.64 C29.1
N$50  (via drill 0.5 pad 0.25)
  Top 0.2: R19.2 45.43,17.64 45.93,18.14 46.43,18.14 47.3,18.77 v48.05,18.77 | U3.13 47.78,20.79 v48.05,20.52
  Bottom 0.2: v48.05,20.52 v48.05,18.77
N$51
  Top 0.2: U3.8 45.28,21.49 44.93,21.14 43.93,21.14 43.43,20.64 43.43,19.64 C38.2
N$52
  Top 0.2: U3.12 47.28,19.79 47.43,19.64 48.93,19.64 | 48.93,19.64 48.93,21.64 48.43,21.64 48.43,21.94 U3.14 | R20.2 47.43,17.64 47.8,17.89 48.43,17.89 48.93,18.52 48.93,19.64
N$53  (via drill 0.5 pad 0.25)
  Top 0.2: U3.9 45.78,20.99 v44.43,19.64
  Bottom 0.2: 43.43,17.14 SJ7.2 44.3,18.65 v44.43,19.64
N$54  (via drill 0.5 pad 0.25)
  Top 0.2: U3.10 46.28,20.79 45.43,19.94 v45.43,19.14
  Bottom 0.2: v45.43,19.14 46.43,17.4 SJ8.2
N$55  (via drill 0.5 pad 0.25)
  Top 0.2: U3.11 46.78,20.29 v46.43,19.64
  Bottom 0.2: v46.43,19.64 46.93,19.14 46.93,18.64 47.68,17.89 48.18,17.89 48.43,17.64 SJ9.2
N$56  (via drill 0.5 pad 0.25)
  Top 0.2: U3.16 54.58,23.49 v54.93,23.14
  Bottom 0.2: 54.93,12.39 v54.93,23.14
  Bottom 0.406: 54.93,12.39 54.93,11.43 54.25,10.75 38.5,10.75 35.25,7.5 35.25,5.23 PL1.7
N$57  (via drill 0.5 pad 0.25)
  Top 0.2: v51.93,25.64 51.28,24.99 U3.19
  Bottom 0.2: v51.93,25.64 52.43,26.14 54.68,26.14 55.93,24.89 55.93,12.89
  Bottom 0.406: 55.93,12.89 55.93,10.93 55,10 39.48,10 PL1.8
N$58
  Top 0.2: U3.6 43.66,23.49 43.43,23.27 43.43,22.29 C39.1
N$59  (via drill 0.5)
  Top 0.2: U2.2 23.76,25.49 v22.75,26.5
  Bottom 0.406: v22.75,26.5 21.66,27.59 R16.1
N$60  (via drill 0.5)
  Top 0.406: U$1.5 57.33,7.08 v57.25,7
  Bottom 0.406: v57.25,7 56,8.25 45.35,8.25 PL1.14
N$61
  Top 0.254: U4.24 66.33,28.74 | 66.98,36.91 J4.3
  Top 0.61: 66.33,28.74 67.23,29.64
  Top 0.813: 67.23,29.64 67.23,34.64 67.2,35.24 67.23,36.14 66.98,36.91
N$62
  Top 0.254: U4.21 68.25,26.02 69.36,26.02 69.48,26.14
  Top 0.61: 69.48,26.14 70.48,26.89 70.48,28.6 71.77,29.89
  Top 0.813: 71.77,29.89 71.77,34.33 J4.4
N$63
  Top 0.254: U4.26 65.33,28.99
  Top 0.61: 65.33,28.99 65.98,29.89
  Top 0.813: 65.98,29.89 65.98,34.89 64.48,36.64 64.48,36.91 J4.2
N$64
  Top 0.2: 61.77,27.1 62.88,25.99
  Top 0.254: U4.1 62.88,25.99
  Top 0.61: 61.52,28.14 61.77,27.1
  Top 0.813: 61.52,28.14 61.52,36.45 J4.1
N$65
  Top 0.254: U4.27 64.83,28.29 | 64.23,31.09 R29.1
  Top 0.305: 64.83,28.29 64.23,28.89
  Top 0.406: 64.23,28.89 64.23,31.09
N$66
  Top 0.2: 66.86,26.91 66.86,28.02
  Top 0.254: 66.86,26.91 U4.23
  Top 0.305: 66.86,28.02 67.36,28.52
  Top 0.406: R30.1 68.68,29.84 67.36,28.52
N$67
  Top 0.2: 72.48,24.02 68.25,24.02
  Top 0.254: 73.93,20.19 73.98,19.64 R31.2 R26.2 70.08,18.09 C40.2 | R25.1 73.93,20.19 | 73.93,20.19 74.03,22.69 74.48,23.14 74.48,23.52 74,24.5 73,24.5 72.52,24.02 72.48,24.02 | 68.25,24.02 U4.17
N$68
  Top 0.254: U4.4 61.13,24.49 60.98,24.64 59.63,24.64 C42.2
N$69
  Top 0.254: U4.5 61.83,23.99 60.98,23.64 C42.1
N$70  (via drill 0.5 pad 0.25)
  Top 0.2: R27.2 64.48,17.64 64.98,18.14 65.48,18.14 66.36,18.77 v67.11,18.77 | U4.13 66.83,20.79 v67.11,20.52
  Bottom 0.2: v67.11,20.52 v67.11,18.77
N$71
  Top 0.2: U4.8 64.33,21.49 63.98,21.14 62.98,21.14 62.48,20.64 62.48,19.64 C51.2
N$72
  Top 0.2: U4.12 66.33,19.79 66.48,19.64 67.98,19.64 | 67.98,19.64 67.98,21.64 67.48,21.64 67.48,21.94 U4.14 | R28.2 66.48,17.64 66.86,17.89 67.48,17.89 67.98,18.52 67.98,19.64
N$73  (via drill 0.5 pad 0.25)
  Top 0.2: U4.9 64.83,20.99 v63.48,19.64
  Bottom 0.2: 62.48,17.14 SJ10.2 63.35,18.65 v63.48,19.64
N$74  (via drill 0.5 pad 0.25)
  Top 0.2: U4.10 65.33,20.79 64.48,19.94 v64.48,19.14
  Bottom 0.2: v64.48,19.14 65.48,17.4 SJ11.2
N$75  (via drill 0.5 pad 0.25)
  Top 0.2: U4.11 65.83,20.29 v65.48,19.64
  Bottom 0.2: v65.48,19.64 65.98,19.14 65.98,18.64 66.73,17.89 67.23,17.89 67.48,17.64 SJ12.2
N$76  (via drill 0.5 pad 0.25)  (1 unrouted)
  Top 0.2: U4.16 73.13,23.49 v73.48,23.64
  Bottom 0.2: 73.48,12.89 v73.48,23.64
  Bottom 0.406: 39.04,4.46 42.25,1.5 72.5,1.5 74.5,3.5 74.5,8.75 73.5,9.75 73.5,12.87 73.48,12.89
N$78
  Top 0.2: U4.6 62.7,23.49 62.48,23.27 62.48,21.79 C52.1
N$79  (via drill 0.6)
  Top 0.406: v60,5.25 60,4.5 60.04,4.46 U$1.9 | R23.1 54.93,14 v60,14
  Bottom 0.406: v60,14 v60,5.25
N$80  (via drill 0.5)
  Top 0.406: U$1.6 58.42,6.42 v58,6
  Bottom 0.406: v58,6 54.75,3 45.85,3 PL1.13
N$81  (via drill 0.5)
  Top 0.406: U$1.16 71.17,7.08 v71.25,7
  Bottom 0.406: v71.25,7 71.25,3.5 70,2.25 43.81,2.25 PL1.11
N$82  (via drill 0.5)
  Top 0.2: U4.2 62.26,25.49 v61,26.5
  Bottom 0.2: v61,26.5 59.75,27.5 58.57,27.5 R32.1
  Bottom 0.254: R32.1 58.5,28
N$83  (via drill 0.5)
  Top 0.2: U1.2 5.26,25.49 v4.25,26.5
  Bottom 0.406: v4.25,26.5 3,27.25 1.99,27.25 R8.1
N$84  (via drill 0.5)
  Top 0.2: U3.2 43.01,25.49 v41.75,26.75
  Bottom 0.2: v41.75,26.75 40.5,28 39.52,28 R24.1
  Bottom 0.254: R24.1 39.5,27.5
N$85  (via drill 0.5 pad 0.25)
  Top 0.2: v70.98,25.64 70.33,24.99 U4.19
  Bottom 0.2: v70.98,25.64 71.48,26.14 73.48,26.14 74.48,25.14 74.48,12.64
  Bottom 0.406: 74.48,12.64 74.5,12.62 74.5,11.25 75.25,10.25 75.25,3 73,0.75 40,0.75 37.75,3 37.75,5.25 39.02,6.52 PL1.10
V+  (via drill 0.5 pad 0.25)
  Top 0.2: U1.22 10.18,27.49 | C13.2 v4.46,23.02 | U4.22 67.33,27.49 | C52.2 v61.6,23.02 | U3.22 48.28,27.49 | C39.2 v42.55,23.02 | U2.22 29.23,27.49 | C26.2 v23.5,23.02 | U4.28 64.33,27.56 64.25,27.64 63.48,27.64 v62.85,27.52
  Top 0.254: 10.21,27.52 10.21,27.41 U1.22 | U1.28 7.18,27.54 6.83,27.77 6.33,27.74 v6.21,27.52 | 10.18,27.49 10.21,27.52 | 10.21,27.52 10.83,28.14 v11.83,27.14 | 67.36,27.52 67.36,27.41 U4.22 | 67.33,27.49 67.36,27.52 | 67.36,27.52 67.36,27.61 67.5,27.75 68.23,27.89 v68.98,27.14 | 48.8,27.77 48.3,27.41 U3.22 | U3.28 45.28,27.54 44.93,27.77 44.43,27.74 v43.8,27.02 | 48.28,27.49 48.8,27.77 | 48.8,27.77 49.43,27.64 v49.93,27.14 | U2.28 26.23,27.54 26.13,27.77 25.38,27.74 v24.75,27.02 | 29.23,27.49 29.5,27.77 30.38,27.64 v30.88,27.14
  Bottom 0.254: 6.33,27.64 v6.21,27.52 | C47.2 69,28.16 | 69,27.61 68.48,27.64 | v49.93,27.14 49.43,27.64 | v30.88,27.14 30.38,27.64
  Bottom 0.406: 62.83,27.54 v62.85,27.52 | 6.18,27.79 v6.21,27.52 | C15.2 24.75,28.34 | C28.2 43.78,28.29 | C34.2 49.95,27.41 v49.93,27.14 50,27.21 | v11.83,27.14 11.75,27.22 | v30.88,27.14 30.75,27.27 30.75,28.5 31,28.75 | 50,28.5 50.25,28.75
  Bottom 0.61: 6.33,27.64 11.33,27.64 v11.83,27.14 11.86,27.41 C8.2 | v4.46,23.02 3.48,23.02 | 68.48,27.64 63.48,27.64 v62.85,27.52 62.73,25.64 61.98,24.64 61.63,24.29 61.63,24.02 v61.6,23.02 | v43.8,27.02 43.68,25.64 42.93,24.64 42.58,24.29 42.58,24.02 v42.55,23.02 | 49.43,27.64 44.55,27.64 v43.8,27.02 | v24.75,27.02 24.63,25.64 23.88,24.64 23.53,24.29 23.53,24.02 v23.5,23.02 | 30.38,27.64 25.38,27.64 v24.75,27.02 | C41.2 62.83,27.54 | 24.75,28.34 v24.75,27.02 | 43.78,28.29 v43.8,27.02
  Bottom 0.813: 69,28.16 69,27.61 v68.98,27.14 | C2.2 6.18,27.79 | C21.2 30.91,27.41 v30.88,27.14 | 31,30.75 9.44,30.75 v6.21,27.52 5.58,25.64 4.83,24.64 3.48,23.29 3.48,23.02 C9.1 2.14,13.39 1.5,12.75 1.5,11.68 C11.+ 1.54,10.71 2.25,10 3.12,10 C10.1 3.25,9.87 3.25,5.5 4.75,4 X1.1 | 31,30.75 50.25,30.75 | 50.25,30.75 67.5,30.75 69,29.25 C47.2 | 31,28.75 31,30.75 | 50,27.21 50,28.5 | 50.25,28.75 50.25,30.75
VDD  (via drill 0.5, 0.5 pad 0.25)  (1 unrouted)
  Top 0.2: v8.33,13.64 9,13.64 9.21,13.64 | C4.2 11.68,21.99 11.33,21.64 11.33,18.14 10.83,17.64 10.83,13.14 10.33,12.64 | v46.43,13.64 47.3,13.64 | C30.2 49.78,21.99 49.43,21.64 49.43,18.14 48.93,17.64 48.93,13.14 48.43,12.64 | C43.2 68.83,21.99 68.48,21.64 68.48,18.14 67.98,17.64 67.98,13.89 67.73,13.64 | v27.38,13.64 28.25,13.64 | C17.2 30.73,21.99 30.38,21.64 30.38,18.14 29.88,17.64 29.88,14.14 29.38,13.64
  Top 0.254: U1.15 12.33,22.99 | 12.33,22.99 14.93,22.99 R1.2 | C4.2 12.33,22.99 | 9.21,13.64 10.33,12.64 10.33,11.1 C7.+ | U3.15 50.43,22.99 | 50.43,22.99 53.03,22.99 R17.2 | C30.2 50.43,22.99 | 47.3,13.64 48.43,12.64 | U4.15 69.48,22.99 | 69.48,22.99 72.08,22.99 R25.2 | C43.2 69.48,22.99 | 66.36,13.64 67.73,13.64 | U2.15 31.38,22.99 | 31.38,22.99 33.98,22.99 R9.2 | C17.2 31.38,22.99 | 28.25,13.64 29.38,13.64
  Top 0.406: R12.1 28.25,15.19 28.25,13.64 | R4.1 9,15.19 9,13.64 | R20.1 47.3,15.19 47.3,13.64 | R28.1 66.36,15.19 66.36,13.64 | U$1.17 69.72,7.71 v70,8 | U$1.15 69.58,6.42 v70,6 69.28,5.79 U$1.14 | 67.57,9.75 69.25,9.75 | U$1.1 U$1.20 | U$1.10 U$1.11 67.65,3.75 68.75,3.75 69,3.5 v69.25,3.5
  Top 0.61: v27.38,13.64 27.38,12.87 27.5,12.75 27.5,12 | 27.5,12 36.75,12 37,12.25 38.5,12.25 38.75,12 46.25,12 | 46.25,12 46.5,12.25 46.5,13.57 v46.43,13.64 | 46.25,12 65,12 65.5,12.5 v65.5,13.75 65.61,13.64 66.36,13.64 | 27.5,12 17.5,12 16.75,12.75 12.25,12.75 10.75,11.25 10.75,10.68 C7.+ | 69.25,9.75 v69.25,10.25
  Bottom 0.2: SJ1.1 SJ2.1 | SJ2.1 SJ3.1 | SJ2.1 7.83,14.14 v8.33,13.64 | SJ7.1 SJ8.1 | SJ8.1 SJ9.1 | SJ8.1 45.93,14.14 v46.43,13.64 | SJ10.1 SJ11.1 SJ12.1 | SJ4.1 SJ5.1 | SJ5.1 SJ6.1 | SJ5.1 26.88,14.14 v27.38,13.64
  Bottom 0.406: 69.25,5.75 69.25,7.75 v70,8 70,8.5 | 69.25,5.75 v69.25,3.5 | v70,6 69.25,5.75 | v65.5,13.75 65.5,14.86 SJ11.1 | 70,8.5 70,9.5 v69.25,10.25 | C18.2 69.75,8.75 70,8.5
  Bottom 0.61: SJ10.1 64.87,15.38 65,15.25 | v69.25,10.25 69.25,10.89 66.5,13.64 65.61,13.64 v65.5,13.75
  Bottom 0.813: PL1.2 26.73,7.02 24.75,9 17.5,9 15.5,7 12.25,7 10.75,8.5 10.75,10.6 C7.+ | C5.1 11.39,12.14 10.75,11.5 10.75,10.68 C7.+ | C7.+ 10.79,9.46 11.5,8.75 12.37,8.75 C6.1
VSS  (via drill 0.5, 0.5 pad 0.25)
  Top 0.2: 14.83,25.02 14.33,24.52 11.11,24.52 | 6.33,25.02 8.08,25.02 8.08,24.52 v8.71,24.52 | C4.1 13.68,20.29 v13.83,20.14 | 2.98,17.49 C12.1 1.86,19.14 1.25,19.75 1.25,21.81 v1.33,21.89 | 2.98,17.49 6.58,13.89 | 6.58,13.89 6.83,13.64 | R5.2 2.03,33.84 2.33,35.14 v2.33,35.64 | 17.33,32.34 R6.2 | R3.1 7.08,14.39 6.58,13.89 | U1.18 9.33,24.49 | 9.33,24.49 8.73,24.49 v8.71,24.52 | v9.58,25.39 v8.71,24.52 | v9.58,23.64 9.58,24.24 9.33,24.49 | v7.83,23.64 U1.EXP 7.83,25.34 v7.83,25.39 | 33.88,25.02 33.38,24.52 30.16,24.52 | 25.38,25.02 27.13,25.02 27.13,24.52 v27.75,24.52 | C17.1 32.73,20.29 v32.88,20.14 | 23.14,16.89 22.03,17.99 C25.1 21.53,18.64 v19.83,18.64 | 23.14,16.89 24.63,15.39 25,15.14 25.49,15.16 R11.1 | R13.2 20.83,33.59 20.88,33.89 | R14.2 36.38,32.34 v36.38,34.64 35.58,35.44 v35.58,37.39 | U2.18 28.38,24.49 | 28.38,24.49 27.78,24.49 v27.75,24.52 | v28.63,25.39 v27.75,24.52 | v28.63,23.64 28.63,24.24 28.38,24.49 | v26.88,23.64 U2.EXP 26.88,25.34 v26.88,25.39 | 52.93,25.02 52.43,24.52 49.2,24.52 | 44.43,25.02 46.18,25.02 46.18,24.52 v46.8,24.52 | C30.1 51.78,20.29 v51.93,20.14 | 42.28,16.29 41.08,17.49 C38.1 40.58,18.64 v38.83,18.64 | 42.28,16.29 43.18,15.39 45.18,15.39 R19.1 | R21.2 40.13,33.84 40.43,34.64 v40.43,35.64 | 55.43,32.34 R22.2 | U3.18 47.43,24.49 | 47.43,24.49 46.83,24.49 v46.8,24.52 | v47.68,25.39 v46.8,24.52 | v47.68,23.64 47.68,24.24 47.43,24.49 | v45.93,23.64 U3.EXP 45.93,25.34 v45.93,25.39 | 71.98,25.02 71.48,24.52 68.25,24.52 | 63.48,25.02 65.23,25.02 65.23,24.52 v65.86,24.52 | C43.1 70.83,20.29 v70.98,20.14 | 60.13,17.49 C51.1 59.02,20.25 58.75,20.25 58.61,20.39 v57.58,20.39 | 60.13,17.49 62.73,15.39 63.73,15.39 R27.1
  Top 0.2: R30.2 74.48,32.34 v74.48,35.14 72.33,37.29 v72.33,37.39 | U4.18 66.48,24.49 | 66.48,24.49 65.88,24.49 v65.86,24.52 | v66.73,25.39 v65.86,24.52 | v66.73,23.64 66.73,24.24 66.48,24.49 | v64.98,23.64 U4.EXP 64.98,25.34 v64.98,25.39 | v16.08,37.14 16.08,35.89 v17.33,34.89 | v55.33,37.39 55.33,35.24 v55.43,35.14 | v56.08,27.39 55.11,27.39 53.87,28.64 | v58.33,16.39 59.03,16.39 60.13,17.49 | 71.5,14.5 71.5,12.47 v71.58,12.39 | U$1.13 71.81,5.12 v72.58,5.89 | 16.5,2.75 15.08,1.33 v15.08,1.14 14.83,1.39 v1.33,1.39 | v1.33,16.39 1.88,16.39 2.98,17.49 | v17.58,27.89 17.58,27.92 17,28.5 14.97,28.5 v14.83,28.64 | v36.83,27.39 36.11,27.39 34.87,28.63 | v40.58,14.64 40.64,14.64 42.28,16.29 | v21.83,15.39 21.83,15.58 23.14,16.89
  Top 0.254: 11.11,24.52 U1.18 | U1.3 4.48,24.99 v3.33,25.64 3.25,25.75 3.25,28.25 3.08,28.42 v3.08,28.64 | C1.1 13.93,15.79 | 13.93,15.79 R2.1 14.88,16.19 | v14.83,25.14 14.96,25.02 14.83,25.02 | 13.93,15.79 13.93,15.04 v14.33,14.64 | 30.16,24.52 U2.18 | U2.3 23.53,24.99 v21.88,25.64 v21.88,28.5 21.88,28.64 | C14.1 32.98,15.79 | 32.98,15.79 R10.1 33.93,16.19 | v33.88,25.14 34.01,25.02 33.88,25.02 | 32.98,15.79 32.98,15.04 v33.38,14.64 | 49.2,24.52 U3.18 | U3.3 42.58,24.99 v40.93,25.64 v40.93,28.64 | C27.1 52.03,15.79 | 52.03,15.79 R18.1 52.98,16.19 | v52.93,25.14 53.05,25.02 52.93,25.02 | 52.03,15.79 52.03,15.04 v52.43,14.64 | 68.25,24.52 U4.18 | U4.3 61.63,24.99 v59.98,25.64 v59.98,28.64 | C40.1 71.08,15.79 | 71.08,15.79 R26.1 72.03,16.19 | v71.98,25.14 72.11,25.02 71.98,25.02 | 71.08,15.79 71.08,15.04 v71.48,14.64
  Top 0.406: R6.2 17.13,29.94 15.83,28.64 v14.83,28.64 14.83,25.02 | R5.2 2.03,29.94 v3.08,28.64 | 17.33,32.34 v17.33,34.89 19.88,34.89 v20.88,35.64 20.88,33.89 | R14.2 36.18,29.94 34.87,28.63 34.74,28.5 v33.88,28.5 33.88,25.02 | R13.2 20.58,30.19 21.88,29.14 v21.88,28.5 | R22.2 55.23,30 53.87,28.64 53.73,28.5 v52.93,28.5 52.93,25.02 | R21.2 40.13,29.94 40.93,29.14 v40.93,28.64 | R30.2 74.28,29.94 71.98,28.64 v71.98,28.5 71.98,25.02 | v59.98,28.64 59.18,29.94 R29.2 59.18,34.91 58.95,35.14 | 36.38,32.34 v36.38,34.63 36.5,34.75 39.54,34.75 v40.43,35.64 | 55.43,32.34 v55.43,35.14 55.43,35.18 55.5,35.25 58.84,35.25 58.95,35.14 | v64.25,13.25 64.25,15.17 R27.1 | 71.5,14.5 71,15 71,15.75 70.96,15.79 C40.1 69.36,13.61 67.75,12 v66.5,12 | 58.95,35.14 v58.98,35.14 | v65.5,8.38 U$1.18 | v65.5,8.38 U$1.3 | U$1.7 64.78,5.79 65.38,6.38 | 65.38,6.38 65.5,6.5 v65.5,8.38 | U$1.13 66.63,5.12 65.38,6.38 | 6.83,13.64 6.83,11.85 C11.-
  Top 0.61: C14.1 v31.25,13.51 v31.25,13.5 | v24.25,13.5 24.25,13.92 25.49,15.16 | 45.18,15.39 45.18,14.43 v44,13.25 | v50.25,13.25 50.25,15.73 C27.1
  Top 0.813: PL1.1 28.88,4.38 26.5,2 17.25,2 16.5,2.75 15.75,3.5 15.75,10.52 C7.-
  Bottom 0.2: v14.83,25.14 14.83,20.14 | 14.83,20.14 14.83,15.14 v14.33,14.64 | v13.83,20.14 14.83,20.14 | R8.2 2.28,25.44 v3.33,25.64 | v33.88,25.14 33.88,20.14 | 33.88,20.14 33.88,15.14 v33.38,14.64 | v32.88,20.14 33.88,20.14 | v52.93,25.14 52.93,20.14 | 52.93,20.14 52.93,15.14 v52.43,14.64 | v51.93,20.14 52.93,20.14 | R24.2 40.38,26.19 v40.93,25.64 | v71.98,25.14 71.98,20.14 | 71.98,20.14 71.98,15.14 v71.48,14.64 | v70.98,20.14 71.98,20.14 | R32.2 59.43,25.69 v59.98,25.64 | v58.33,3.39 62.64,3.39 65.5,6.25 v65.5,8.38 | v36.83,0.89 v29.08,0.89 29.08,4.28 PL1.1
  Bottom 0.254: 10.33,14.14 13.83,14.14 14.33,13.64 | 14.33,13.64 14.33,12.29 C5.2 | v14.33,14.64 14.33,13.64 | 61.13,28.54 C41.1
  Bottom 0.406: 65.5,11.5 v65.5,8.38 65.87,8.75 C18.1 | 65.5,11.5 65.5,12 v64.25,13.25 | v59.98,28.64 60.1,28.64 C41.1 | C47.1 70.95,28.52 v71.98,28.5 | v3.08,28.64 3.51,28.64 C2.1 | C8.1 14.61,28.86 v14.83,28.64 | v21.88,25.64 21.83,25.69 R16.2 | C15.1 22.42,28.5 v21.88,28.5 | C21.1 33.77,28.36 v33.88,28.5 | C28.1 40.96,28.61 v40.93,28.64 | C34.1 52.82,28.61 v52.93,28.5 | v66.5,12 65.5,11.5 | 10.33,14.14 10.33,14.08 8,11.75 6.73,11.75 C11.-
  Bottom 0.61: v31.25,13.5 30.25,12.5 25.25,12.5 v24.25,13.5 | v44,13.25 45,12.25 49.25,12.25 v50.25,13.25
  Bottom 0.813: C6.2 15.14,8.64 15.75,9.25 15.75,10.52 C7.- 15.75,10.76 15.75,11.5 15.11,12.14 C5.2 | C9.2 6.19,13.39 6.83,12.75 6.83,11.85 C11.- | C10.2 5.89,9.89 6.5,10.5 6.5,11.52 C11.- | X1.2 10.29,4.71 6.75,8.25 6.75,11.51 C11.-
  other vias: 57.25,10
  pour Bottom: 0,40 76,40 76,0 0,0
  pour Top: 0,40 0,0 76,0 76,40

### Text on the board
tPlace: PaPArray V1.0